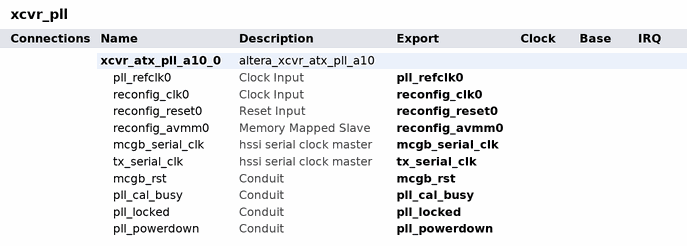
[diagram p0: system contents]
# Platform Designer (Qsys) system xcvr_pll, Arria 10 10AXF40AA
# Parameters at their usual value, and those the tool derives, are not listed.
package require -exact qsys 20.1
create_system xcvr_pll
set_project_property DEVICE_FAMILY {Arria 10}
set_project_property DEVICE 10AXF40AA

add_instance xcvr_atx_pll_a10_0 altera_xcvr_atx_pll_a10 20.1
set_instance_property xcvr_atx_pll_a10_0 AUTO_EXPORT true
set_instance_parameter_value xcvr_atx_pll_a10_0 base_device NIGHTFURY5
set_instance_parameter_value xcvr_atx_pll_a10_0 bw_sel low
set_instance_parameter_value xcvr_atx_pll_a10_0 enable_analog_resets 0
set_instance_parameter_value xcvr_atx_pll_a10_0 enable_bonding_clks 0
set_instance_parameter_value xcvr_atx_pll_a10_0 enable_ext_lockdetect_ports 0
set_instance_parameter_value xcvr_atx_pll_a10_0 enable_hfreq_clk 1
set_instance_parameter_value xcvr_atx_pll_a10_0 enable_manual_configuration 1
set_instance_parameter_value xcvr_atx_pll_a10_0 enable_mcgb 1
set_instance_parameter_value xcvr_atx_pll_a10_0 enable_pll_reconfig 1
set_instance_parameter_value xcvr_atx_pll_a10_0 generate_docs 1
set_instance_parameter_value xcvr_atx_pll_a10_0 pma_width 40
set_instance_parameter_value xcvr_atx_pll_a10_0 rcfg_enable_avmm_busy_port 0
set_instance_parameter_value xcvr_atx_pll_a10_0 rcfg_h_file_enable 1
set_instance_parameter_value xcvr_atx_pll_a10_0 rcfg_jtag_enable 1
set_instance_parameter_value xcvr_atx_pll_a10_0 rcfg_mif_file_enable 1
set_instance_parameter_value xcvr_atx_pll_a10_0 rcfg_multi_enable 1
set_instance_parameter_value xcvr_atx_pll_a10_0 rcfg_profile_cnt 3
set_instance_parameter_value xcvr_atx_pll_a10_0 rcfg_profile_data0 {rcfg_debug 0 enable_pll_reconfig 1 rcfg_jtag_enable 1 rcfg_separate_avmm_busy 1 rcfg_enable_avmm_busy_port 0 set_capability_reg_enable 1 set_user_identifier 0 set_csr_soft_logic_enable 1 enable_pld_atx_cal_busy_port 1 support_mode user_mode prot_mode Basic bw_sel low refclk_cnt 1 refclk_index 0 primary_pll_buffer {GX clock output buffer} enable_8G_path 1 enable_16G_path 0 enable_pcie_clk 0 enable_cascade_out 0 enable_hip_cal_done_port 0 set_hip_cal_en 0 set_output_clock_frequency 5156.25 set_auto_reference_clock_frequency 312.5 set_manual_reference_clock_frequency 100.0 set_fref_clock_frequency 100.0 set_m_counter 1 set_ref_clk_div 1 set_l_counter 2 set_l_cascade_counter 4 set_l_cascade_predivider 1 set_k_counter 1 enable_mcgb 1 mcgb_div 1 enable_hfreq_clk 1 enable_mcgb_pcie_clksw 0 mcgb_aux_clkin_cnt 0 enable_bonding_clks 0 enable_fb_comp_bonding 0 pma_width 40 enable_pld_mcgb_cal_busy_port 0}
set_instance_parameter_value xcvr_atx_pll_a10_0 rcfg_profile_data1 {rcfg_debug 0 enable_pll_reconfig 1 rcfg_jtag_enable 1 rcfg_separate_avmm_busy 1 rcfg_enable_avmm_busy_port 0 set_capability_reg_enable 1 set_user_identifier 0 set_csr_soft_logic_enable 1 enable_pld_atx_cal_busy_port 1 support_mode user_mode prot_mode Basic bw_sel low refclk_cnt 1 refclk_index 0 primary_pll_buffer {GX clock output buffer} enable_8G_path 1 enable_16G_path 0 enable_pcie_clk 0 enable_cascade_out 0 enable_hip_cal_done_port 0 set_hip_cal_en 0 set_output_clock_frequency 5468.75 set_auto_reference_clock_frequency 312.5 set_manual_reference_clock_frequency 100.0 set_fref_clock_frequency 100.0 set_m_counter 1 set_ref_clk_div 1 set_l_counter 2 set_l_cascade_counter 4 set_l_cascade_predivider 1 set_k_counter 1 enable_mcgb 1 mcgb_div 1 enable_hfreq_clk 1 enable_mcgb_pcie_clksw 0 mcgb_aux_clkin_cnt 0 enable_bonding_clks 0 enable_fb_comp_bonding 0 pma_width 40 enable_pld_mcgb_cal_busy_port 0}
set_instance_parameter_value xcvr_atx_pll_a10_0 rcfg_profile_data2 {rcfg_debug 0 enable_pll_reconfig 1 rcfg_jtag_enable 1 rcfg_separate_avmm_busy 1 rcfg_enable_avmm_busy_port 0 set_capability_reg_enable 1 set_user_identifier 0 set_csr_soft_logic_enable 1 enable_pld_atx_cal_busy_port 1 support_mode user_mode prot_mode Basic bw_sel low refclk_cnt 1 refclk_index 0 primary_pll_buffer {GX clock output buffer} enable_8G_path 1 enable_16G_path 0 enable_pcie_clk 0 enable_cascade_out 0 enable_hip_cal_done_port 0 set_hip_cal_en 0 set_output_clock_frequency 6250.0 set_auto_reference_clock_frequency 312.5 set_manual_reference_clock_frequency 100.0 set_fref_clock_frequency 100.0 set_m_counter 1 set_ref_clk_div 1 set_l_counter 2 set_l_cascade_counter 4 set_l_cascade_predivider 1 set_k_counter 1 enable_mcgb 1 mcgb_div 1 enable_hfreq_clk 1 enable_mcgb_pcie_clksw 0 mcgb_aux_clkin_cnt 0 enable_bonding_clks 0 enable_fb_comp_bonding 0 pma_width 40 enable_pld_mcgb_cal_busy_port 0}
set_instance_parameter_value xcvr_atx_pll_a10_0 rcfg_profile_select 2
set_instance_parameter_value xcvr_atx_pll_a10_0 rcfg_reduced_files_enable 0
set_instance_parameter_value xcvr_atx_pll_a10_0 rcfg_separate_avmm_busy 1
set_instance_parameter_value xcvr_atx_pll_a10_0 rcfg_sv_file_enable 1
set_instance_parameter_value xcvr_atx_pll_a10_0 set_auto_reference_clock_frequency 312.5
set_instance_parameter_value xcvr_atx_pll_a10_0 set_capability_reg_enable 1
set_instance_parameter_value xcvr_atx_pll_a10_0 set_csr_soft_logic_enable 1
set_instance_parameter_value xcvr_atx_pll_a10_0 set_fref_clock_frequency 100.0
set_instance_parameter_value xcvr_atx_pll_a10_0 set_k_counter 1
set_instance_parameter_value xcvr_atx_pll_a10_0 set_l_cascade_counter 4
set_instance_parameter_value xcvr_atx_pll_a10_0 set_l_cascade_predivider 1
set_instance_parameter_value xcvr_atx_pll_a10_0 set_l_counter 2
set_instance_parameter_value xcvr_atx_pll_a10_0 set_m_counter 1
set_instance_parameter_value xcvr_atx_pll_a10_0 set_manual_reference_clock_frequency 100.0
set_instance_parameter_value xcvr_atx_pll_a10_0 set_output_clock_frequency 6250.0
set_instance_parameter_value xcvr_atx_pll_a10_0 set_rcfg_emb_strm_enable 1

# exported interfaces
add_interface mcgb_rst conduit end
set_interface_property mcgb_rst EXPORT_OF xcvr_atx_pll_a10_0.mcgb_rst
add_interface mcgb_serial_clk hssi_serial_clock start
set_interface_property mcgb_serial_clk EXPORT_OF xcvr_atx_pll_a10_0.mcgb_serial_clk
add_interface pll_cal_busy conduit end
set_interface_property pll_cal_busy EXPORT_OF xcvr_atx_pll_a10_0.pll_cal_busy
add_interface pll_locked conduit end
set_interface_property pll_locked EXPORT_OF xcvr_atx_pll_a10_0.pll_locked
add_interface pll_powerdown conduit end
set_interface_property pll_powerdown EXPORT_OF xcvr_atx_pll_a10_0.pll_powerdown
add_interface pll_refclk0 clock sink
set_interface_property pll_refclk0 EXPORT_OF xcvr_atx_pll_a10_0.pll_refclk0
add_interface reconfig_avmm0 avalon slave
set_interface_property reconfig_avmm0 EXPORT_OF xcvr_atx_pll_a10_0.reconfig_avmm0
add_interface reconfig_clk0 clock sink
set_interface_property reconfig_clk0 EXPORT_OF xcvr_atx_pll_a10_0.reconfig_clk0
add_interface reconfig_reset0 reset sink
set_interface_property reconfig_reset0 EXPORT_OF xcvr_atx_pll_a10_0.reconfig_reset0
add_interface tx_serial_clk hssi_serial_clock start
set_interface_property tx_serial_clk EXPORT_OF xcvr_atx_pll_a10_0.tx_serial_clk

set_interconnect_requirement {$system} qsys_mm.clockCrossingAdapter HANDSHAKE
set_interconnect_requirement {$system} qsys_mm.insertDefaultSlave FALSE
set_interconnect_requirement {$system} qsys_mm.maxAdditionalLatency 1

save_system xcvr_pll.qsys
